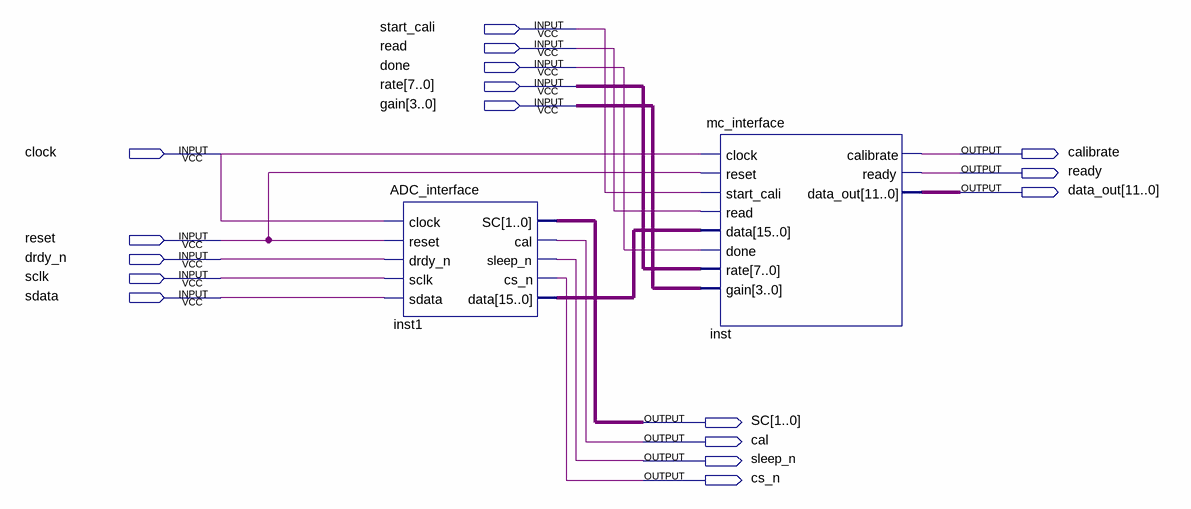
[diagram p0: schematic sheet]
// Quartus schematic top.bdf as structural Verilog: 2 symbols, 17 pins
module top (
  input  start_cali,
  input  read,
  input  done,
  input  [7:0] rate,
  input  [3:0] gain,
  input  clock,
  input  reset,
  input  drdy_n,
  input  sclk,
  input  sdata,
  output calibrate,
  output ready,
  output [11:0] data_out,
  output [1:0] SC,
  output cal,
  output sleep_n,
  output cs_n
);

  wire [15:0] inst1_data;

  ADC_interface inst1 (
    .clock(clock), .reset(reset), .drdy_n(drdy_n), .sclk(sclk), .sdata(sdata), .SC(SC), .cal(cal),
    .sleep_n(sleep_n), .cs_n(cs_n), .data(inst1_data));
  mc_interface inst (
    .clock(clock), .reset(reset), .start_cali(start_cali), .read(read), .data(inst1_data), .done(done),
    .rate(rate), .gain(gain), .calibrate(calibrate), .ready(ready), .data_out(data_out));
endmodule
